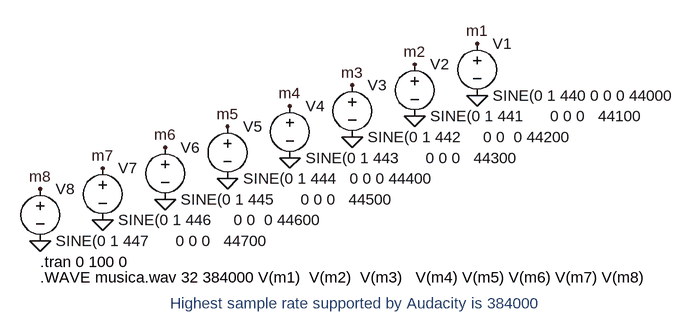
[diagram p0: schematic music.asc]
music.asc, the LTspice schematic file:
Version 4
SHEET 1 880 752
FLAG 96 416 0
FLAG 96 336 m1
FLAG 0 368 m2
FLAG -96 480 0
FLAG -96 400 m3
FLAG -192 432 m4
FLAG -288 544 0
FLAG -288 464 m5
FLAG -384 496 m6
FLAG -480 608 0
FLAG -480 528 m7
FLAG -576 560 m8
FLAG 0 448 0
FLAG -192 512 0
FLAG -576 640 0
FLAG -384 576 0
SYMBOL voltage 96 320 R0
WINDOW 123 0 0 Left 0
WINDOW 39 0 0 Left 0
SYMATTR InstName V1
SYMATTR Value SINE(0 1 440 0 0 0 44000
SYMBOL voltage 0 352 R0
WINDOW 123 0 0 Left 0
WINDOW 39 0 0 Left 0
SYMATTR InstName V2
SYMATTR Value SINE(0 1 441      0 0 0   44100
SYMBOL voltage -96 384 R0
WINDOW 123 0 0 Left 0
WINDOW 39 0 0 Left 0
SYMATTR InstName V3
SYMATTR Value SINE(0 1 442     0 0  0 44200
SYMBOL voltage -192 416 R0
WINDOW 123 0 0 Left 0
WINDOW 39 0 0 Left 0
SYMATTR InstName V4
SYMATTR Value SINE(0 1 443      0 0 0   44300
SYMBOL voltage -288 448 R0
WINDOW 123 0 0 Left 0
WINDOW 39 0 0 Left 0
SYMATTR InstName V5
SYMATTR Value SINE(0 1 444   0 0 0 44400
SYMBOL voltage -384 480 R0
WINDOW 123 0 0 Left 0
WINDOW 39 0 0 Left 0
SYMATTR InstName V6
SYMATTR Value SINE(0 1 445      0 0 0   44500
SYMBOL voltage -480 512 R0
WINDOW 123 0 0 Left 0
WINDOW 39 0 0 Left 0
SYMATTR InstName V7
SYMATTR Value SINE(0 1 446     0 0  0 44600
SYMBOL voltage -576 544 R0
WINDOW 123 0 0 Left 0
WINDOW 39 0 0 Left 0
SYMATTR InstName V8
SYMATTR Value SINE(0 1 447      0 0 0   44700
TEXT -576 672 Left 2 !.tran 0 100 0
TEXT -576 696 Left 2 !.WAVE musica.wav 32 384000 V(m1)  V(m2)  V(m3)   V(m4) V(m5) V(m6) V(m7) V(m8)
TEXT -376 736 Left 2 ;Highest sample rate supported by Audacity is 384000

The netlist it stands for:
* music.asc
V1 m1 0 SINE(0 1 440 0 0 0 44000
V2 m2 0 SINE(0 1 441      0 0 0   44100
V3 m3 0 SINE(0 1 442     0 0  0 44200
V4 m4 0 SINE(0 1 443      0 0 0   44300
V5 m5 0 SINE(0 1 444   0 0 0 44400
V6 m6 0 SINE(0 1 445      0 0 0   44500
V7 m7 0 SINE(0 1 446     0 0  0 44600
V8 m8 0 SINE(0 1 447      0 0 0   44700
.tran 0 100 0
.WAVE musica.wav 32 384000 V(m1)  V(m2)  V(m3)   V(m4) V(m5) V(m6) V(m7) V(m8)
* Highest sample rate supported by Audacity is 384000
.backanno
.end